# Altium schematic sheet fan-regulator.SchDoc
size A
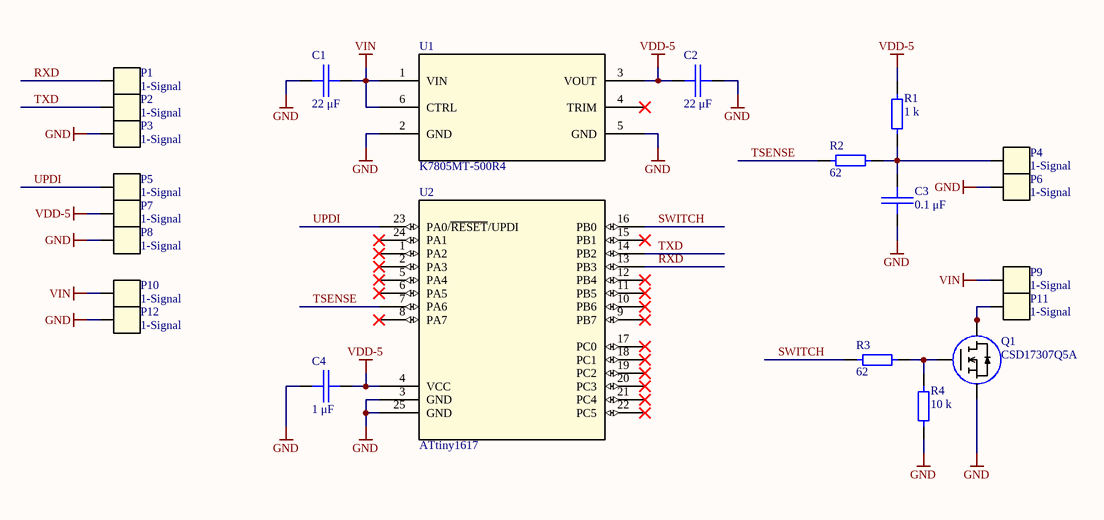
[diagram p0: fan-regulator.SchDoc]

## Parts
C1  22 μF  [1210]
C2  22 μF  [1210]
C3  0.1 μF  [0603]
C4  1 μF  [0603]
P1  1-Signal  [1-SignalSmall]
P2  1-Signal  [1-SignalSmall]
P3  1-Signal  [1-SignalSmall]
P4  1-Signal  [1-SignalSmall]
P5  1-Signal  [1-SignalSmall]
P6  1-Signal  [1-SignalSmall]
P7  1-Signal  [1-SignalSmall]
P8  1-Signal  [1-SignalSmall]
P9  1-Signal  [1-SignalSmall]
P10  1-Signal  [1-SignalSmall]
P11  1-Signal  [1-SignalSmall]
P12  1-Signal  [1-SignalSmall]
Q1  CSD17307Q5A  [SON Q5A]
R1  1 k  [0603]
R2  62  [0603]
R3  62  [0603]
R4  10 k  [0603]
U1  K7805MT-500R4  [K78xxMT-500R4]
U2  ATtiny1617  [VQFN24]

## Nets
GND: C1.1 C2.2 C3.1 C4.2 P3.1 P6.1 P8.1 P12.1 Q1.1(S) Q1.2(S) Q1.3(S) R4.1 U1.2(GND) U1.5(GND) U2.3(GND) U2.25(GND)
VDD-5: C2.1 C4.1 P7.1 R1.2 U1.3(VOUT) U2.4(VCC)
VIN: C1.2 P9.1 P10.1 U1.1(VIN) U1.6(CTRL)
RXD: P1.1 U2.13(PB3)
SWITCH: R3.1 U2.16(PB0)
TSENSE: R2.1 U2.7(PA6)
TXD: P2.1 U2.14(PB2)
UPDI: P5.1 U2.23(PA0/~{RESET}/UPDI)
NetC3_2: C3.2 P4.1 R1.1 R2.2
NetP11_1: P11.1 Q1.5(D) Q1.6(D) Q1.7(D) Q1.8(D)
NetQ1_4: Q1.4(G) R3.2 R4.2

Not connected (* = marked no-connect by the designer): U1 4(TRIM)*; U2 1(PA2)* 2(PA3)* 5(PA4)* 6(PA5)* 8(PA7)* 9(PB7)* 10(PB6)* 11(PB5)* 12(PB4)* 15(PB1)* 17(PC0)* 18(PC1)* 19(PC2)* 20(PC3)* 21(PC4)* 22(PC5)* 24(PA1)*

## Library data of the parts
C1-C4 = Cap
R1-R4 = Res
U1 = K78xxMT-500R4
U2 = ATtiny1617/3217